# Altium schematic sheet 2-PWR_MANAGE.SchDoc
size A4
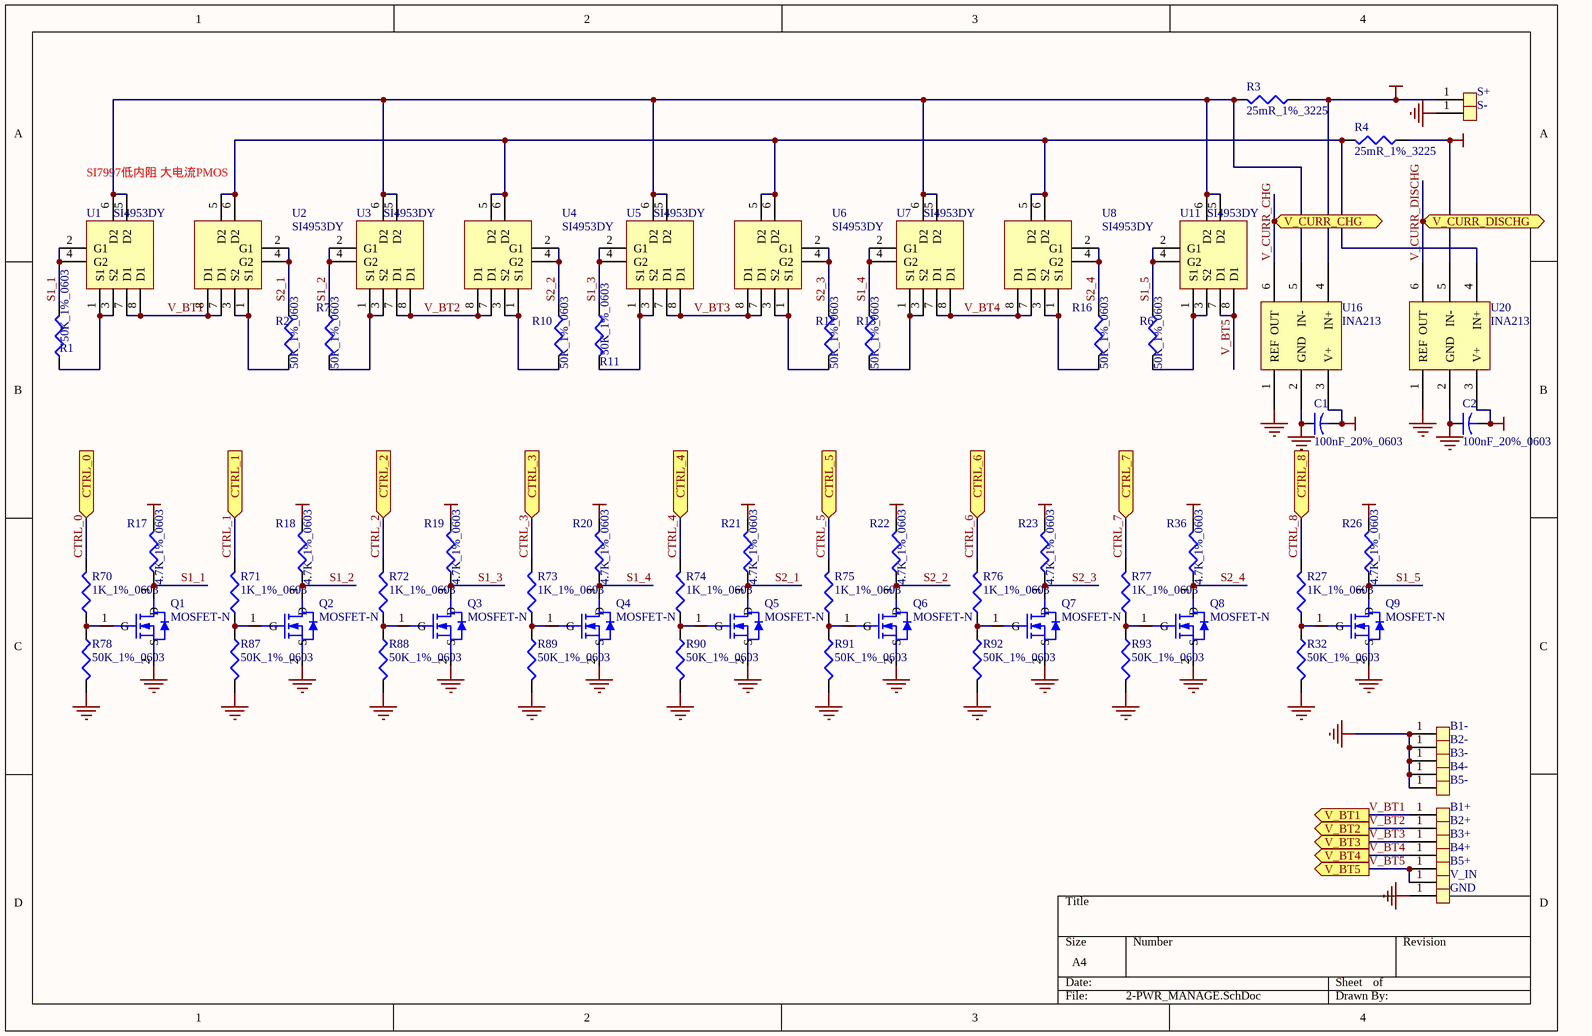
[diagram p0: 2-PWR_MANAGE.SchDoc]

## Parts
B1+  ND  [END_1.5_2.8]  (value not drawn)
B1-  ND  [END_1.5_2.8]  (value not drawn)
B2+  ND  [END_1.5_2.8]  (value not drawn)
B2-  ND  [END_1.5_2.8]  (value not drawn)
B3+  ND  [END_1.5_2.8]  (value not drawn)
B3-  ND  [END_1.5_2.8]  (value not drawn)
B4+  ND  [END_1.5_2.8]  (value not drawn)
B4-  ND  [END_1.5_2.8]  (value not drawn)
B5+  ND  [END_1.5_2.8]  (value not drawn)
B5-  ND  [END_1.5_2.8]  (value not drawn)
C1  100nF_20%_0603  [C1608-0603]
C2  100nF_20%_0603  [C1608-0603]
GND  ND  [END_3_6]  (value not drawn)
Q1  MOSFET-N  [SO-G3/C2.5]
Q2  MOSFET-N  [SO-G3/C2.5]
Q3  MOSFET-N  [SO-G3/C2.5]
Q4  MOSFET-N  [SO-G3/C2.5]
Q5  MOSFET-N  [SO-G3/C2.5]
Q6  MOSFET-N  [SO-G3/C2.5]
Q7  MOSFET-N  [SO-G3/C2.5]
Q8  MOSFET-N  [SO-G3/C2.5]
Q9  MOSFET-N  [SO-G3/C2.5]
R1  50K_1%_0603  [C1608-0603]
R2  50K_1%_0603  [C1608-0603]
R3  25mR_1%_3225  [CR6332-2512]
R4  25mR_1%_3225  [CR6332-2512]
R6  50K_1%_0603  [C1608-0603]
R7  50K_1%_0603  [C1608-0603]
R10  50K_1%_0603  [C1608-0603]
R11  50K_1%_0603  [C1608-0603]
R12  50K_1%_0603  [C1608-0603]
R13  50K_1%_0603  [C1608-0603]
R16  50K_1%_0603  [C1608-0603]
R17  4.7K_1%_0603  [C1608-0603]
R18  4.7K_1%_0603  [C1608-0603]
R19  4.7K_1%_0603  [C1608-0603]
R20  4.7K_1%_0603  [C1608-0603]
R21  4.7K_1%_0603  [C1608-0603]
R22  4.7K_1%_0603  [C1608-0603]
R23  4.7K_1%_0603  [C1608-0603]
R26  4.7K_1%_0603  [C1608-0603]
R27  1K_1%_0603  [C1608-0603]
R32  50K_1%_0603  [C1608-0603]
R36  4.7K_1%_0603  [C1608-0603]
R70  1K_1%_0603  [C1608-0603]
R71  1K_1%_0603  [C1608-0603]
R72  1K_1%_0603  [C1608-0603]
R73  1K_1%_0603  [C1608-0603]
R74  1K_1%_0603  [C1608-0603]
R75  1K_1%_0603  [C1608-0603]
R76  1K_1%_0603  [C1608-0603]
R77  1K_1%_0603  [C1608-0603]
R78  50K_1%_0603  [C1608-0603]
R87  50K_1%_0603  [C1608-0603]
R88  50K_1%_0603  [C1608-0603]
R89  50K_1%_0603  [C1608-0603]
R90  50K_1%_0603  [C1608-0603]
R91  50K_1%_0603  [C1608-0603]
R92  50K_1%_0603  [C1608-0603]
R93  50K_1%_0603  [C1608-0603]
S+  ND  [END_1.5_2.8]  (value not drawn)
S-  ND  [END_1.5_2.8]  (value not drawn)
U1  SI4953DY  [SO-8]
U2  SI4953DY  [SO-8]
U3  SI4953DY  [SO-8]
U4  SI4953DY  [SO-8]
U5  SI4953DY  [SO-8]
U6  SI4953DY  [SO-8]
U7  SI4953DY  [SO-8]
U8  SI4953DY  [SO-8]
U11  SI4953DY  [SO-8]
U16  INA213  [SC70-6]
U20  INA213  [SC70-6]
V_IN  ND  [END_3_6]  (value not drawn)

## Ports
CTRL_0 (in), CTRL_1 (in), CTRL_2 (in), CTRL_3 (in), CTRL_4 (in), CTRL_5 (in), CTRL_6 (in), CTRL_7 (in), CTRL_8 (in), V_BT1 (out), V_BT2 (out), V_BT3 (out), V_BT4 (out), V_BT5 (out), V_CURR_CHG (out), V_CURR_DISCHG (out)

## Nets
GND: B1-.1(SW) B2-.1(SW) B3-.1(SW) B4-.1(SW) B5-.1(SW) C1.1 C2.1 GND.1(SW) Q1.2(S) Q2.2(S) Q3.2(S) Q4.2(S) Q5.2(S) Q6.2(S) Q7.2(S) Q8.2(S) Q9.2(S) R32.2 R78.2 R87.2 R88.2 R89.2 R90.2 R91.2 R92.2 R93.2 S-.1(SW) U16.1(REF) U16.2(GND) U20.1(REF) U20.2(GND)
VCC_2V8: C1.2 C2.2 U16.3(V+) U20.3(V+)
VCC_5V: R17.2 R18.2 R19.2 R20.2 R21.2 R22.2 R23.2 R26.2 R36.2
VCC_BAT: R4.1 U20.5(IN-)
VCC_CHARGE: R3.1 S+.1(SW) U16.4(IN+)
CTRL_0: R70.2 ; port CTRL_0
CTRL_1: R71.2 ; port CTRL_1
CTRL_2: R72.2 ; port CTRL_2
CTRL_3: R73.2 ; port CTRL_3
CTRL_4: R74.2 ; port CTRL_4
CTRL_5: R75.2 ; port CTRL_5
CTRL_6: R76.2 ; port CTRL_6
CTRL_7: R77.2 ; port CTRL_7
CTRL_8: R27.2 ; port CTRL_8
S1_1: Q1.3(D) R1.2 R17.1 U1.2(G1) U1.4(G2)
S1_2: Q2.3(D) R7.1 R18.1 U3.2(G1) U3.4(G2)
S1_3: Q3.3(D) R11.1 R19.1 U5.2(G1) U5.4(G2)
S1_4: Q4.3(D) R13.1 R20.1 U7.2(G1) U7.4(G2)
S1_5: Q9.3(D) R6.1 R26.1 U11.2(G1) U11.4(G2)
S2_1: Q5.3(D) R2.1 R21.1 U2.2(G1) U2.4(G2)
S2_2: Q6.3(D) R10.1 R22.1 U4.2(G1) U4.4(G2)
S2_3: Q7.3(D) R12.1 R23.1 U6.2(G1) U6.4(G2)
S2_4: Q8.3(D) R16.1 R36.1 U8.2(G1) U8.4(G2)
V_BT1: B1+.1(SW) U1.7(D1) U1.8(D1) U2.7(D1) U2.8(D1) ; port V_BT1
V_BT2: B2+.1(SW) U3.7(D1) U3.8(D1) U4.7(D1) U4.8(D1) ; port V_BT2
V_BT3: B3+.1(SW) U5.7(D1) U5.8(D1) U6.7(D1) U6.8(D1) ; port V_BT3
V_BT4: B4+.1(SW) U7.7(D1) U7.8(D1) U8.7(D1) U8.8(D1) ; port V_BT4
V_BT5: B5+.1(SW) U11.7(D1) U11.8(D1) V_IN.1(SW) ; port V_BT5
V_CURR_CHG: U16.6(OUT) ; port V_CURR_CHG
V_CURR_DISCHG: U20.6(OUT) ; port V_CURR_DISCHG
NetQ1_1: Q1.1(G) R70.1 R78.1
NetQ2_1: Q2.1(G) R71.1 R87.1
NetQ3_1: Q3.1(G) R72.1 R88.1
NetQ4_1: Q4.1(G) R73.1 R89.1
NetQ5_1: Q5.1(G) R74.1 R90.1
NetQ6_1: Q6.1(G) R75.1 R91.1
NetQ7_1: Q7.1(G) R76.1 R92.1
NetQ8_1: Q8.1(G) R77.1 R93.1
NetQ9_1: Q9.1(G) R27.1 R32.1
NetR1_1: R1.1 U1.1(S1) U1.3(S2)
NetR2_2: R2.2 U2.1(S1) U2.3(S2)
NetR3_2: R3.2 U1.5(D2) U1.6(D2) U3.5(D2) U3.6(D2) U5.5(D2) U5.6(D2) U7.5(D2) U7.6(D2) U11.5(D2) U11.6(D2) U16.5(IN-)
NetR4_2: R4.2 U2.5(D2) U2.6(D2) U4.5(D2) U4.6(D2) U6.5(D2) U6.6(D2) U8.5(D2) U8.6(D2) U20.4(IN+)
NetR6_2: R6.2 U11.1(S1) U11.3(S2)
NetR7_2: R7.2 U3.1(S1) U3.3(S2)
NetR10_2: R10.2 U4.1(S1) U4.3(S2)
NetR11_2: R11.2 U5.1(S1) U5.3(S2)
NetR12_2: R12.2 U6.1(S1) U6.3(S2)
NetR13_2: R13.2 U7.1(S1) U7.3(S2)
NetR16_2: R16.2 U8.1(S1) U8.3(S2)

## Notes on the sheet
- SI7997低内阻 大电流PMOS

## Library data of the parts
C1 C2 = Cap2: Capacitor; Value: 0.1uF 20% 0603; Published: 23-Sep-2002; Publisher: Altium Limited
R1 R2 R6 R7 R10-R13 R16-R23 R26 R27 R32 R36 R70-R78 R87-R93 = Res3: Resistor; Value: 1K%5 0603; Published: 8-Jun-2000; Revision: July-2002: Re-released for DXP Platform.; Publisher: Altium Limited
R3 R4 = Res3: Resistor; Value: 150R %5 0603; Published: 8-Jun-2000; Revision: July-2002: Re-released for DXP Platform.; Publisher: Altium Limited